# Altium schematic sheet DDR4X.SchDoc
size A3; Author: Nguyễn Hữu Thắng; DrawnBy: Nguyễn Hữu Thắng; SheetNumber: 3; SheetTotal: 12